# EAGLE design ChordController (EAGLE 5.10)

## Sheet 1 of 2
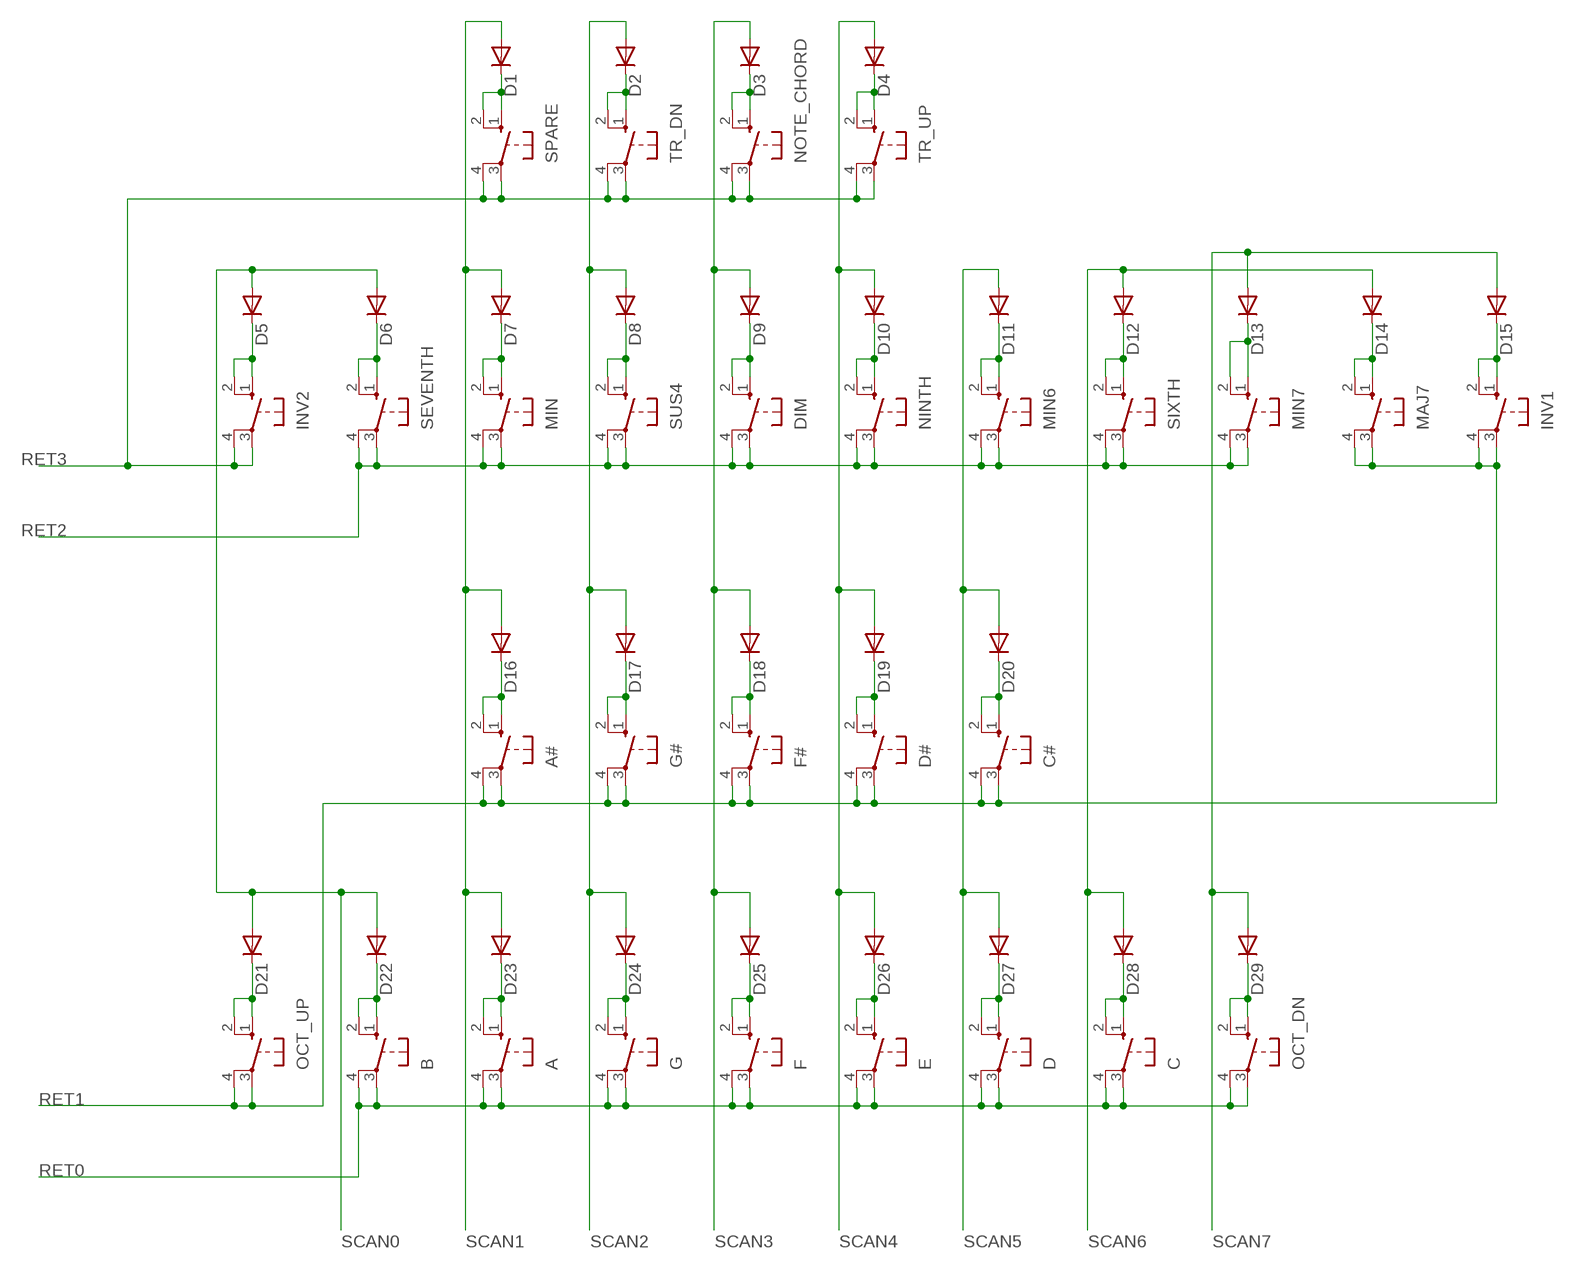
[diagram p0: schematic, sheet 1]

### Parts
A  40-XX  [B3F-40XX]
A#  40-XX  [B3F-40XX]
B  40-XX  [B3F-40XX]
C  40-XX  [B3F-40XX]
C#  40-XX  [B3F-40XX]
D  40-XX  [B3F-40XX]
D1  1N4148DO35-7  [DO35-7]
D2  1N4148DO35-7  [DO35-7]
D3  1N4148DO35-7  [DO35-7]
D4  1N4148DO35-7  [DO35-7]
D5  1N4148DO35-7  [DO35-7]
D6  1N4148DO35-7  [DO35-7]
D7  1N4148DO35-7  [DO35-7]
D8  1N4148DO35-7  [DO35-7]
D9  1N4148DO35-7  [DO35-7]
D10  1N4148DO35-7  [DO35-7]
D11  1N4148DO35-7  [DO35-7]
D12  1N4148DO35-7  [DO35-7]
D13  1N4148DO35-7  [DO35-7]
D14  1N4148DO35-7  [DO35-7]
D15  1N4148DO35-7  [DO35-7]
D16  1N4148DO35-7  [DO35-7]
D17  1N4148DO35-7  [DO35-7]
D18  1N4148DO35-7  [DO35-7]
D19  1N4148DO35-7  [DO35-7]
D20  1N4148DO35-7  [DO35-7]
D21  1N4148DO35-7  [DO35-7]
D22  1N4148DO35-7  [DO35-7]
D23  1N4148DO35-7  [DO35-7]
D24  1N4148DO35-7  [DO35-7]
D25  1N4148DO35-7  [DO35-7]
D26  1N4148DO35-7  [DO35-7]
D27  1N4148DO35-7  [DO35-7]
D28  1N4148DO35-7  [DO35-7]
D29  1N4148DO35-7  [DO35-7]
D#  40-XX  [B3F-40XX]
DIM  40-XX  [B3F-40XX]
E  40-XX  [B3F-40XX]
F  40-XX  [B3F-40XX]
F#  40-XX  [B3F-40XX]
G  40-XX  [B3F-40XX]
G#  40-XX  [B3F-40XX]
INV1  40-XX  [B3F-40XX]
INV2  40-XX  [B3F-40XX]
MAJ7  40-XX  [B3F-40XX]
MIN  40-XX  [B3F-40XX]
MIN6  40-XX  [B3F-40XX]
MIN7  40-XX  [B3F-40XX]
NINTH  40-XX  [B3F-40XX]
NOTE_CHORD  40-XX  [B3F-40XX]
OCT_DN  40-XX  [B3F-40XX]
OCT_UP  40-XX  [B3F-40XX]
SEVENTH  40-XX  [B3F-40XX]
SIXTH  40-XX  [B3F-40XX]
SPARE  40-XX  [B3F-40XX]
SUS4  40-XX  [B3F-40XX]
TR_DN  40-XX  [B3F-40XX]
TR_UP  40-XX  [B3F-40XX]

### Nets
N$6: D1.C SPARE.1(S) SPARE.2(S1)
N$13: D2.C TR_DN.1(S) TR_DN.2(S1)
N$14: D3.C NOTE_CHORD.1(S) NOTE_CHORD.2(S1)
N$15: D4.C TR_UP.1(S) TR_UP.2(S1)
N$16: D13.C MIN7.1(S) MIN7.2(S1)
N$17: D15.C INV1.1(S) INV1.2(S1)
N$18: D5.C INV2.1(S) INV2.2(S1)
N$19: D6.C SEVENTH.1(S) SEVENTH.2(S1)
N$20: D11.C MIN6.1(S) MIN6.2(S1)
N$21: D10.C NINTH.1(S) NINTH.2(S1)
N$22: D14.C MAJ7.1(S) MAJ7.2(S1)
N$23: D9.C DIM.1(S) DIM.2(S1)
N$24: D8.C SUS4.1(S) SUS4.2(S1)
N$25: D7.C MIN.1(S) MIN.2(S1)
N$26: A#.1(S) A#.2(S1) D16.C
N$27: D17.C G#.1(S) G#.2(S1)
N$28: D18.C F#.1(S) F#.2(S1)
N$29: D19.C D#.1(S) D#.2(S1)
N$30: C#.1(S) C#.2(S1) D20.C
N$31: B.1(S) B.2(S1) D22.C
N$32: A.1(S) A.2(S1) D23.C
N$33: D21.C OCT_UP.1(S) OCT_UP.2(S1)
N$34: D24.C G.1(S) G.2(S1)
N$35: D25.C F.1(S) F.2(S1)
N$36: D26.C E.1(S) E.2(S1)
N$37: D27.C D.1(S) D.2(S1)
N$38: C.1(S) C.2(S1) D28.C
N$39: D29.C OCT_DN.1(S) OCT_DN.2(S1)
N$40: D12.C SIXTH.1(S) SIXTH.2(S1)
RET0: A.3(P) A.4(P1) B.3(P) B.4(P1) C.3(P) C.4(P1) D.3(P) D.4(P1) E.3(P) E.4(P1) F.3(P) F.4(P1) G.3(P) G.4(P1) OCT_DN.3(P) OCT_DN.4(P1) ; also sheet 2
RET1: A#.3(P) A#.4(P1) C#.3(P) C#.4(P1) D#.3(P) D#.4(P1) F#.3(P) F#.4(P1) G#.3(P) G#.4(P1) INV1.3(P) INV1.4(P1) MAJ7.3(P) MAJ7.4(P1) OCT_UP.3(P) OCT_UP.4(P1) ; also sheet 2
RET2: DIM.3(P) DIM.4(P1) MIN6.3(P) MIN6.4(P1) MIN7.3(P) MIN7.4(P1) MIN.3(P) MIN.4(P1) NINTH.3(P) NINTH.4(P1) SEVENTH.3(P) SEVENTH.4(P1) SIXTH.3(P) SIXTH.4(P1) SUS4.3(P) SUS4.4(P1) ; also sheet 2
RET3: INV2.3(P) INV2.4(P1) NOTE_CHORD.3(P) NOTE_CHORD.4(P1) SPARE.3(P) SPARE.4(P1) TR_DN.3(P) TR_DN.4(P1) TR_UP.3(P) TR_UP.4(P1) ; also sheet 2
SCAN0: D5.A D6.A D21.A D22.A ; also sheet 2
SCAN1: D1.A D7.A D16.A D23.A ; also sheet 2
SCAN2: D2.A D8.A D17.A D24.A ; also sheet 2
SCAN3: D3.A D9.A D18.A D25.A ; also sheet 2
SCAN4: D4.A D10.A D19.A D26.A ; also sheet 2
SCAN5: D11.A D20.A D27.A ; also sheet 2
SCAN6: D12.A D14.A D28.A ; also sheet 2
SCAN7: D13.A D15.A D29.A ; also sheet 2

## Sheet 2 of 2
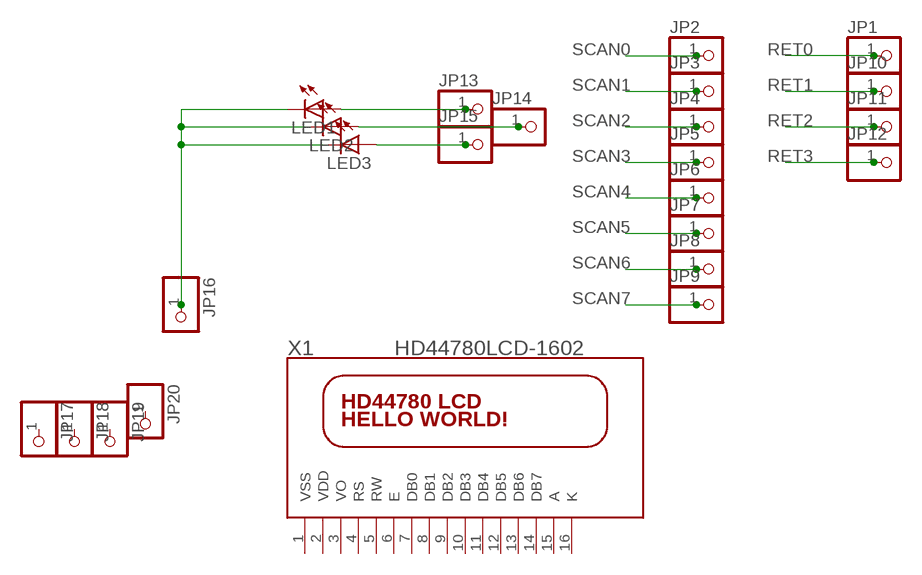
[diagram p1: schematic, sheet 2]

### Parts
JP1  PINHD-1X1  [1X01]
JP2  PINHD-1X1  [1X01]
JP3  PINHD-1X1  [1X01]
JP4  PINHD-1X1  [1X01]
JP5  PINHD-1X1  [1X01]
JP6  PINHD-1X1  [1X01]
JP7  PINHD-1X1  [1X01]
JP8  PINHD-1X1  [1X01]
JP9  PINHD-1X1  [1X01]
JP10  PINHD-1X1  [1X01]
JP11  PINHD-1X1  [1X01]
JP12  PINHD-1X1  [1X01]
JP13  PINHD-1X1  [1X01]
JP14  PINHD-1X1  [1X01]
JP15  PINHD-1X1  [1X01]
JP16  PINHD-1X1  [1X01]
JP17  PINHD-1X1  [1X01]
JP18  PINHD-1X1  [1X01]
JP19  PINHD-1X1  [1X01]
JP20  PINHD-1X1  [1X01]
LED1  LED3MM  [LED3MM]
LED2  LED3MM  [LED3MM]
LED3  LED3MM  [LED3MM]
X1  HD44780LCD-1602  [LCD1602]

### Nets
GND: JP16.1 LED1.K(C) LED2.K(C) LED3.K(C)
N$1: JP13.1 LED1.A
N$2: JP14.1 LED2.A
N$3: JP15.1 LED3.A
RET0: JP1.1 ; also sheet 1
RET1: JP10.1 ; also sheet 1
RET2: JP11.1 ; also sheet 1
RET3: JP12.1 ; also sheet 1
SCAN0: JP2.1 ; also sheet 1
SCAN1: JP3.1 ; also sheet 1
SCAN2: JP4.1 ; also sheet 1
SCAN3: JP5.1 ; also sheet 1
SCAN4: JP6.1 ; also sheet 1
SCAN5: JP7.1 ; also sheet 1
SCAN6: JP8.1 ; also sheet 1
SCAN7: JP9.1 ; also sheet 1
Unconnected: JP17.1 JP18.1 JP19.1 JP20.1 X1.1(VSS) X1.2(VDD) X1.3(VO) X1.4(RS) X1.5(RW) X1.6(E) X1.7(DB0) X1.8(DB1) X1.9(DB2) X1.10(DB3) X1.11(DB4) X1.12(DB5) X1.13(DB6) X1.14(DB7) X1.15(A) X1.16(K)

## Library data of the parts
A A# B C C# D D# DIM E F F# G G# INV1 INV2 MAJ7 MIN MIN6 MIN7 NINTH NOTE_CHORD OCT_DN OCT_UP SEVENTH SIXTH SPARE SUS4 TR_DN TR_UP = switch-omron:40-XX: OMRON SWITCH
D1-D29 = diode:1N4148: DIODE high speed (Philips)
JP1-JP20 = adafruit:PINHD-1X1: Pin header 1x1 for 0.1" spacing With round pins
LED1-LED3 = led:LED: LED OSRAM: - CHIPLED LG R971, LG N971, LY N971, LG Q971, LY Q971, LO R971, LY R971 LH N974, LH R974 LS Q976, LO Q976, LY Q976 LO Q996 - Hyper CHIPLED LW Q18S LB Q993, LB Q99A, LB R99A - SideLED LS A670, LO A670, LY A670, LG A670, LP A670 LB A673, LV A673, LT A673, LW A673 LH A674 LY A675 LS A676, LA A676, LO A676, LY A676, LW A676 LS A679, LY A679, LG A679 - Hyper Micro SIDELED® LS Y876, LA Y876, LO Y876, LY Y876 LT Y87S - SmartLED LW L88C, LW L88S LB L89C, LB L89S, LG L890 LS L89K, LO L89K, LY L89K LS L896, LA L896, LO L896, LY L896 - TOPLED LS T670, LO T670, LY T670, LG T670, LP T670 LSG T670, LSP T670, LSY T670, LOP T670, LYG T670 LG T671, LOG T671, LSG T671 LB T673, LV T673, LT T673, LW T673 LH T674 LS T676, LA T676, LO T676, LY T676, LB T676, LH T676, LSB T676, LW T676 LB T67C, LV T67C, LT T67C, LS T67K, LO T67K, LY T67K, LW E67C LS E67B, LA E67B, LO E67B, LY E67B, LB E67C, LV E67C, LT E67C LW T67C LS T679, LY T679, LG T679 LS T770, LO T770, LY T770, LG T770, LP T770 LB T773, LV T773, LT T773, LW T773 LH T774 LS E675, LA E675, LY E675, LS T675 LS T776, LA T776, LO T776, LY T776, LB T776 LHGB T686 LT T68C, LB T68C - Hyper Mini TOPLED® LB M676 - Mini TOPLED Santana® LG M470 LS M47K, LO M47K, LY M47K Source: http://www.osram.convergy.de LUXEON: - LUMILED® LXK2-PW12-R00, LXK2-PW12-S00, LXK2-PW14-U00, LXK2-PW14-V00 LXK2-PM12-R00, LXK2-PM12-S00, LXK2-PM14-U00 LXK2-PE12-Q00, LXK2-PE12-R00, LXK2-PE12-S00, LXK2-PE14-T00, LXK2-PE14-U00 LXK2-PB12-K00, LXK2-PB12-L00, LXK2-PB12-M00, LXK2-PB14-N00, LXK2-PB14-P00, LXK2-PB14-Q00 LXK2-PR12-L00, LXK2-PR12-M00, LXK2-PR14-Q00, LXK2-PR14-R00 LXK2-PD12-Q00, LXK2-PD12-R00, LXK2-PD12-S00 LXK2-PH12-R00, LXK2-PH12-S00 LXK2-PL12-P00, LXK2-PL12-Q00, LXK2-PL12-R00 Source: www.luxeon.com KINGBRIGHT: KA-3528ASYC Source: www.kingbright.com
X1 = adafruit:HD44780LCD: HD44780 LCD Standard character type LCDs, available in sizes from 8x1 to 40x4!

## Board
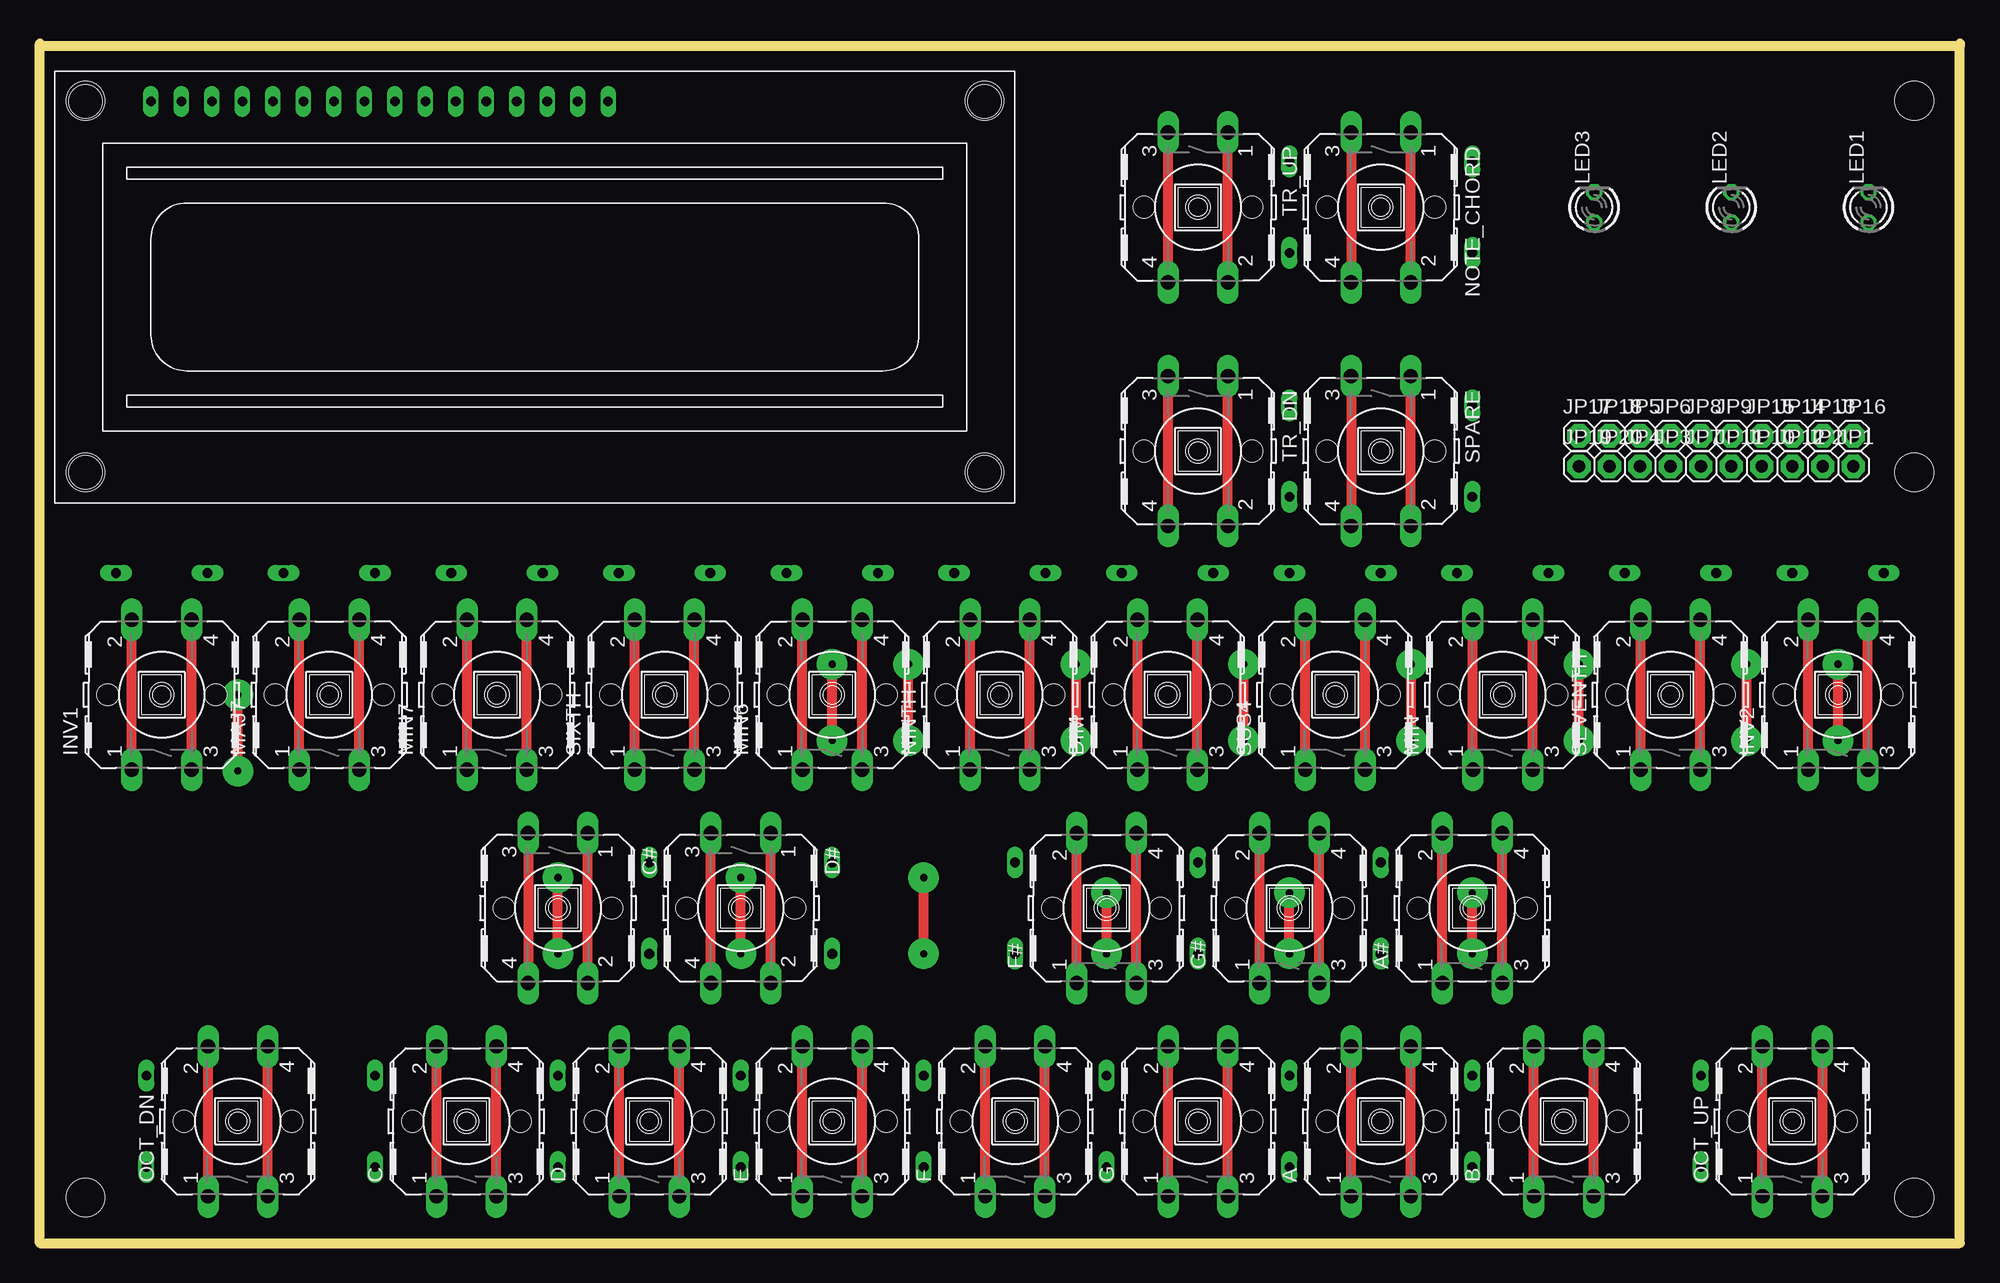
[diagram p2: board, top side]
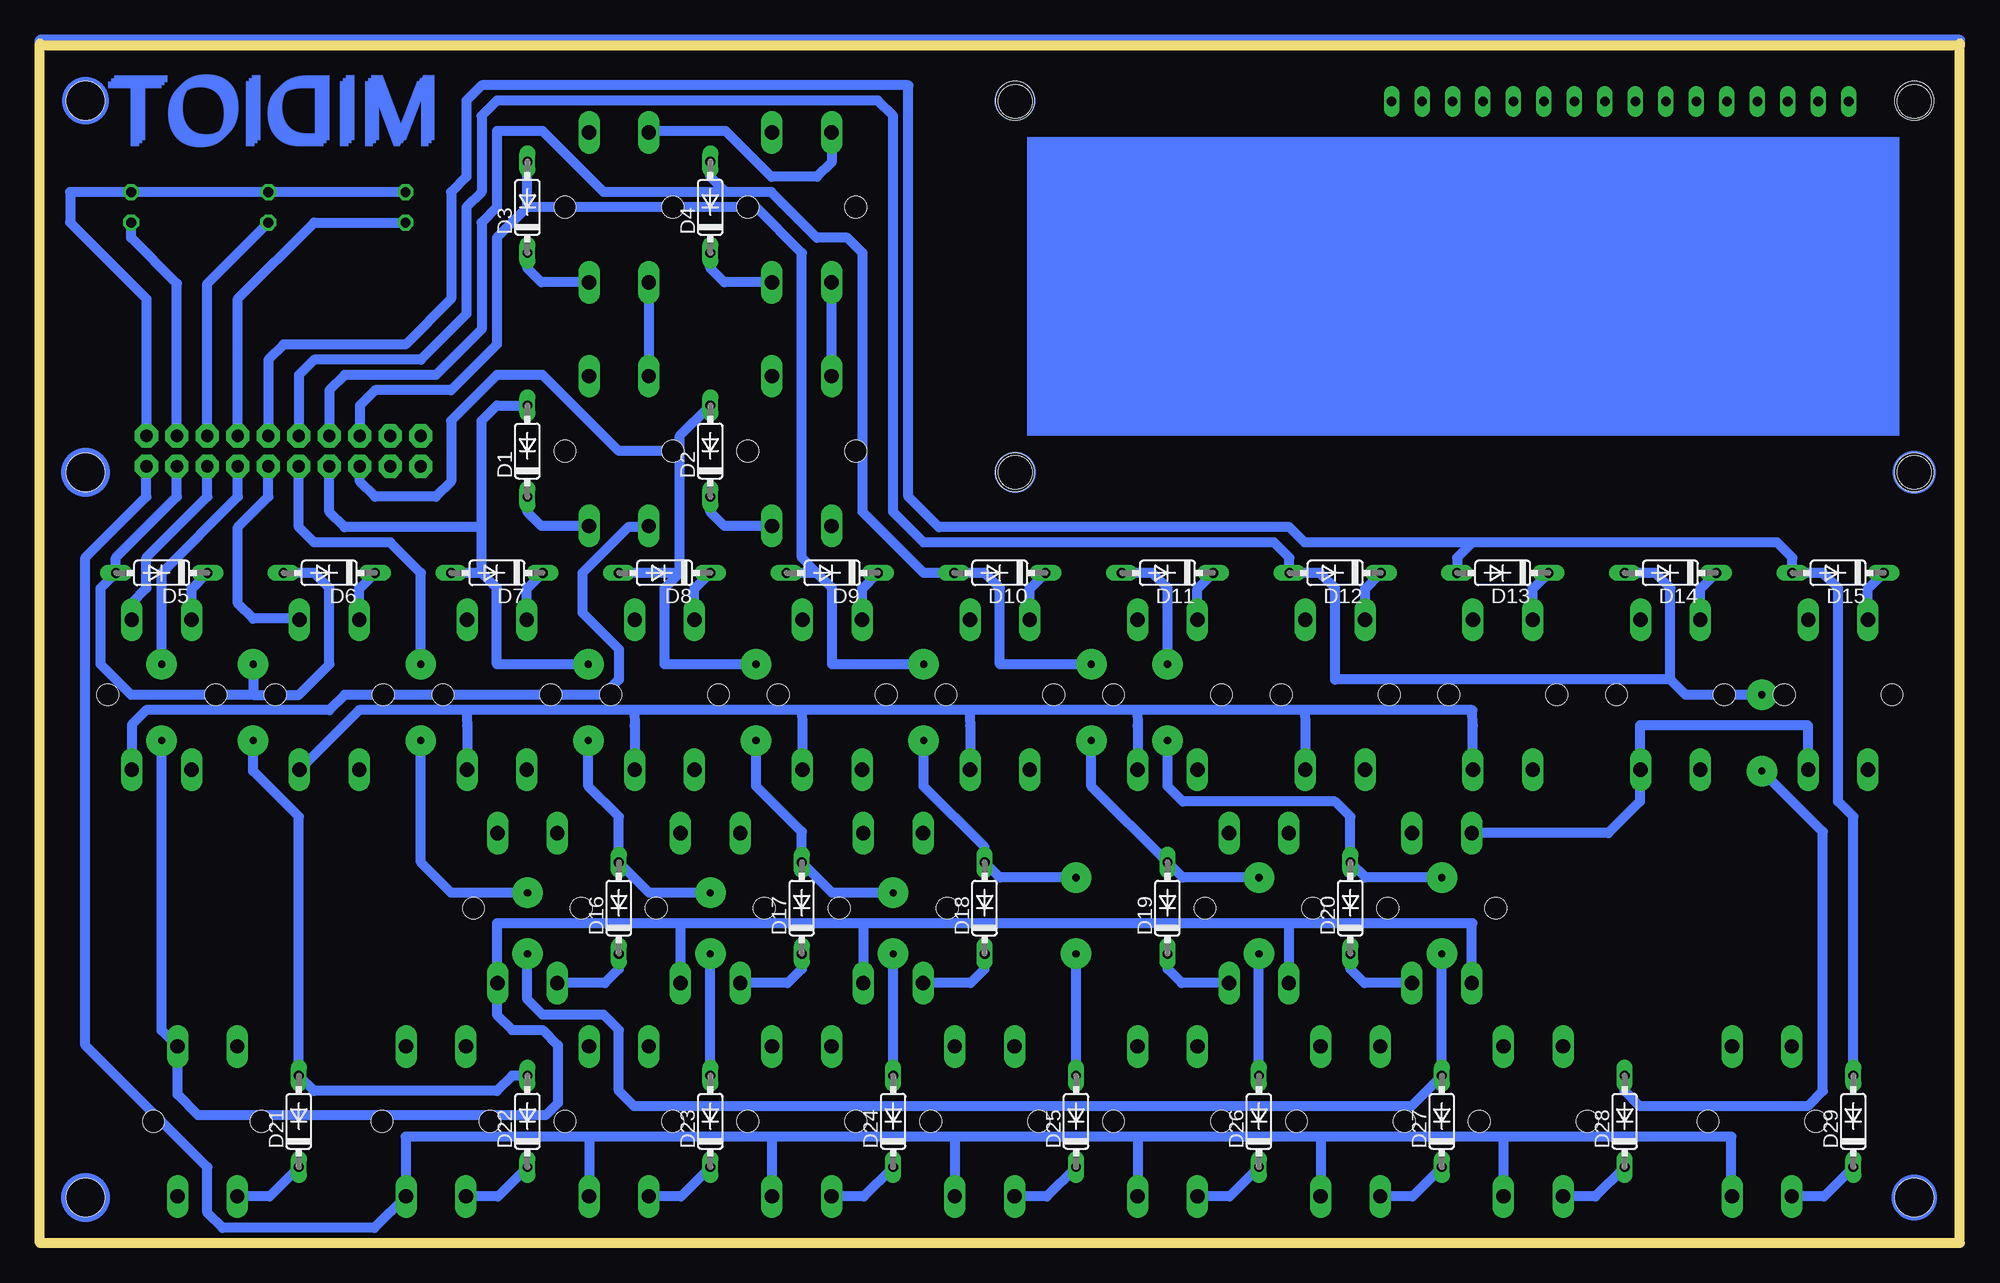
[diagram p3: board, bottom side, seen from below]

Size 160.02 x 100 mm. Coordinates in mm from the lower left corner, seen from the top.
Outline: 0,99.82 0,0 160.02,0 160.02,100
Outline: 0,99.82 0,100
Outline: 0,99.82 160.02,99.82
Copper layers (1*16): Top 0.035mm / dielectric 1.5mm / Bottom 0.035mm
Design rules "default": minimum track width 10mil, minimum drill 24mil, track to track 8mil, track to pad 8mil, pad to pad 8mil, via to via 8mil, smd to smd 8mil, copper to edge 40mil, drill to drill 8mil, minimum pad ring 10mil, minimum via ring 8mil, stop-mask expansion 4mil, vias tented up to drill 0mil, thermal gap 10mil
Holes 3.2 mm at 156.21,95.25 3.81,95.25 156.21,3.81 3.81,3.81 3.81,64.26 78.74,95.25 78.74,64.26 156.21,64.26

### Footprints (pad centres in the part's own frame; a part is rotated, then mirrored left to right if it is on the bottom)
B3F-40XX = drill 1.194 long: 1 -6.248,2.489; 2 6.248,2.489; 3 -6.248,-2.489; 4 6.248,-2.489 | hole 1.803: 0,-4.496; 0,4.496
DO35-7 = drill 0.813 long: A 3.81,0; C -3.81,0
1X01 = drill 1.016 pad 1.93 octagon: 1 0,0
LED3MM = drill 0.813 octagon: A -1.27,0; K 1.27,0
LCD1602 = drill 0.8 long: 1 8,33.46; 2 10.54,33.46; 3 13.08,33.46; 4 15.62,33.46; 5 18.16,33.46; 6 20.7,33.46; 7 23.24,33.46; 8 25.78,33.46; 9 28.32,33.46; 10 30.86,33.46; 11 33.4,33.46; 12 35.94,33.46; 13 38.48,33.46; 14 41.02,33.46; 15 43.56,33.46; 16 46.1,33.46 | hole 2.8: 2.54,2.54; 2.54,33.46; 77.46,33.46; 77.46,2.54

### Placement (x,y rotation side)
A  111.76,10.16 90 top
A#  119.38,27.94 90 top
B  127,10.16 90 top
C  35.56,10.16 90 top
C#  43.18,27.94 270 top
D  50.8,10.16 90 top
D1  119.38,66.04 90 bottom
D2  104.14,66.04 90 bottom
D3  119.38,86.36 90 bottom
D4  104.14,86.36 90 bottom
D5  149.86,55.88 180 bottom
D6  135.89,55.88 180 bottom
D7  121.92,55.88 180 bottom
D8  107.95,55.88 180 bottom
D9  93.98,55.88 180 bottom
D10  80.01,55.88 180 bottom
D11  66.04,55.88 180 bottom
D12  52.07,55.88 180 bottom
D13  38.1,55.88 180 bottom
D14  24.13,55.88 180 bottom
D15  10.16,55.88 180 bottom
D16  111.76,27.94 90 bottom
D17  96.52,27.94 90 bottom
D18  81.28,27.94 90 bottom
D19  66.04,27.94 90 bottom
D20  50.8,27.94 90 bottom
D21  138.43,10.16 90 bottom
D22  119.38,10.16 90 bottom
D23  104.14,10.16 90 bottom
D24  88.9,10.16 90 bottom
D25  73.66,10.16 90 bottom
D26  58.42,10.16 90 bottom
D27  43.18,10.16 90 bottom
D28  27.94,10.16 90 bottom
D29  8.89,10.16 90 bottom
D#  58.42,27.94 270 top
DIM  93.98,45.72 90 top
E  66.04,10.16 90 top
F  81.28,10.16 90 top
F#  88.9,27.94 90 top
G  96.52,10.16 90 top
G#  104.14,27.94 90 top
INV1  10.16,45.72 90 top
INV2  149.86,45.72 90 top
JP1  151.13,64.77 0 top
JP2  148.59,64.77 0 top
JP3  135.89,64.77 0 top
JP4  133.35,64.77 0 top
JP5  133.35,67.31 0 top
JP6  135.89,67.31 0 top
JP7  138.43,64.77 0 top
JP8  138.43,67.31 0 top
JP9  140.97,67.31 0 top
JP10  143.51,64.77 0 top
JP11  140.97,64.77 0 top
JP12  146.05,64.77 0 top
JP13  148.59,67.31 0 top
JP14  146.05,67.31 0 top
JP15  143.51,67.31 0 top
JP16  151.13,67.31 0 top
JP17  128.27,67.31 0 top
JP18  130.81,67.31 0 top
JP19  128.27,64.77 0 top
JP20  130.81,64.77 0 top
LED1  152.4,86.36 90 top
LED2  140.97,86.36 90 top
LED3  129.54,86.36 90 top
MAJ7  24.13,45.72 90 top
MIN  121.92,45.72 90 top
MIN6  66.04,45.72 90 top
MIN7  38.1,45.72 90 top
NINTH  80.01,45.72 90 top
NOTE_CHORD  111.76,86.36 270 top
OCT_DN  16.51,10.16 90 top
OCT_UP  146.05,10.16 90 top
SEVENTH  135.89,45.72 90 top
SIXTH  52.07,45.72 90 top
SPARE  111.76,66.04 270 top
SUS4  107.95,45.72 90 top
TR_DN  96.52,66.04 270 top
TR_UP  96.52,86.36 270 top
X1  1.27,61.72 0 top

### Tracks (layer width: path | path; a pad name or v marks a point on that pad's centre or on a via)
GND
  Bottom 0.813: JP16.1 151.13,78.74 157.48,85.09 157.48,87.63 LED1.K LED2.K LED3.K
N$1
  Bottom 0.813: JP13.1 148.59,80.01 152.4,83.82 LED1.A
N$2
  Bottom 0.813: JP14.1 146.05,80.01 LED2.A
N$3
  Bottom 0.813: JP15.1 143.51,78.74 137.16,85.09 LED3.A
N$6
  Top 0.813: SPARE.2 SPARE.1
  Bottom 0.813: SPARE.2 118.21,59.79 119.38,60.96 D1.C
N$8
  Bottom 0.813: 160.02,0 160.02,100.33 0,100.33 0,0 160.02,0
N$13
  Top 0.813: TR_DN.2 TR_DN.1
  Bottom 0.813: TR_DN.2 102.97,59.79 104.14,60.96 D2.C
N$14
  Top 0.813: NOTE_CHORD.2 NOTE_CHORD.1
  Bottom 0.813: NOTE_CHORD.2 118.21,80.11 119.38,81.28 D3.C
N$15
  Top 0.813: TR_UP.2 TR_UP.1
  Bottom 0.813: TR_UP.2 102.97,80.11 104.14,81.28 D4.C
N$16
  Top 0.813: MIN7.1 MIN7.2
  Bottom 0.813: MIN7.2 35.61,54.56 D13.C
N$17
  Top 0.813: INV1.1 INV1.2
  Bottom 0.813: INV1.2 7.67,54.56 D15.C
N$18
  Top 0.813: INV2.1 INV2.2
  Bottom 0.813: INV2.2 147.37,54.56 D5.C
N$19
  Top 0.813: SEVENTH.1 SEVENTH.2
  Bottom 0.813: SEVENTH.2 133.4,54.56 D6.C
N$20
  Top 0.813: MIN6.1 MIN6.2
  Bottom 0.813: MIN6.2 63.55,54.56 D11.C
N$21
  Top 0.813: NINTH.1 NINTH.2
  Bottom 0.813: NINTH.2 77.52,54.56 D10.C
N$22
  Top 0.813: MAJ7.1 MAJ7.2
  Bottom 0.813: MAJ7.2 21.64,54.56 D14.C
N$23
  Top 0.813: DIM.1 DIM.2
  Bottom 0.813: DIM.2 91.49,54.56 D9.C
N$24
  Top 0.813: SUS4.1 SUS4.2
  Bottom 0.813: SUS4.2 105.46,54.56 D8.C
N$25
  Top 0.813: MIN.1 MIN.2
  Bottom 0.813: MIN.2 119.43,54.56 D7.C
N$26
  Top 0.813: A#.1 A#.2
  Bottom 0.813: A#.1 112.93,21.69 111.76,22.86 D16.C
N$27
  Top 0.813: G#.1 G#.2
  Bottom 0.813: G#.1 97.69,21.69 96.52,22.86 D17.C
N$28
  Top 0.813: F#.1 F#.2
  Bottom 0.813: F#.1 82.45,21.69 81.28,22.86 D18.C
N$29
  Top 0.813: D#.1 D#.2 60.91,21.64 60.96,21.59
  Bottom 0.813: D#.2 64.87,21.69 66.04,22.86 D19.C
N$30
  Top 0.813: C#.2 C#.1
  Bottom 0.813: C#.2 49.63,21.69 50.8,22.86 D20.C
N$31
  Top 0.813: B.1 B.2
  Bottom 0.813: B.1 121.82,3.91 D22.C
N$32
  Top 0.813: A.1 A.2
  Bottom 0.813: A.1 106.58,3.91 D23.C
N$33
  Top 0.813: OCT_UP.1 OCT_UP.2
  Bottom 0.813: OCT_UP.1 140.87,3.91 D21.C
N$34
  Top 0.813: G.1 G.2
  Bottom 0.813: G.1 91.34,3.91 D24.C
N$35
  Top 0.813: F.1 F.2
  Bottom 0.813: F.1 76.1,3.91 D25.C
N$36
  Top 0.813: E.1 E.2
  Bottom 0.813: E.1 60.86,3.91 D26.C
N$37
  Top 0.813: D.1 D.2
  Bottom 0.813: D.1 45.62,3.91 D27.C
N$38
  Top 0.813: C.1 C.2
  Bottom 0.813: C.1 30.38,3.91 D28.C
N$39
  Top 0.813: OCT_DN.1 OCT_DN.2
  Bottom 0.813: OCT_DN.1 11.33,3.91 D29.C
N$40
  Top 0.813: SIXTH.1 SIXTH.2
  Bottom 0.813: SIXTH.2 49.58,54.56 D12.C
RET0
  Top 0.813: OCT_DN.3 OCT_DN.4 | C.3 C.4 | D.3 D.4 | E.3 E.4 | F.3 F.4 | G.3 G.4 | A.3 A.4 | B.3 B.4
  Bottom 0.813: C.3 38.05,8.84 38.1,8.89 | 38.1,8.89 53.34,8.89 | 53.34,8.89 68.58,8.89 | 68.58,8.89 83.82,8.89 | 83.82,8.89 99.06,8.89 | 99.06,8.89 114.3,8.89 | 114.3,8.89 129.54,8.89 129.54,3.96 B.3 132.13,1.27 144.78,1.27 146.05,2.54 146.05,6.35 156.21,16.51 156.21,57.15 151.13,62.23 JP1.1 | A.3 114.25,8.84 114.3,8.89 | G.3 99.01,8.84 99.06,8.89 | F.3 83.77,8.84 83.82,8.89 | E.3 68.53,8.84 68.58,8.89 | D.3 53.29,8.84 53.34,8.89 | 38.1,8.89 19.05,8.89 19.05,3.96 OCT_DN.3
RET1  (via drill 0.6 pad 2.54)
  Top 0.813: v149.86,41.91 v149.86,48.26 | INV1.3 INV1.4 | MAJ7.3 MAJ7.4 | C#.3 C#.4 | D#.4 D#.3 | F#.3 F#.4 | G#.3 G#.4 | A#.3 A#.4 | OCT_UP.4 OCT_UP.3
  Bottom 0.813: C#.4 40.69,26.62 40.64,26.67 55.88,26.67 | 55.88,26.67 91.44,26.67 | 91.44,26.67 106.68,26.67 | 106.68,26.67 121.92,26.67 121.92,21.74 | 121.92,21.74 A#.3 | G#.3 106.63,26.62 106.68,26.67 | F#.3 91.39,26.62 91.44,26.67 | D#.4 55.93,26.62 55.88,26.67 | INV1.3 12.65,43.13 12.7,43.18 26.67,43.18 26.67,39.52 MAJ7.3 26.67,39.42 26.67,36.83 29.31,34.19 C#.3 | 121.92,21.74 121.92,19.05 120.65,17.78 118.11,17.78 116.84,16.51 116.84,11.68 117.86,10.67 146.81,10.67 148.54,12.39 OCT_UP.4 149.86,17.73 v149.86,41.91 | 148.59,3.81 148.59,3.86 OCT_UP.3 | v149.86,48.26 149.86,55.88 143.51,62.23 JP10.1
RET2
  Top 0.813: MIN7.3 MIN7.4 | SIXTH.3 SIXTH.4 | MIN6.3 MIN6.4 | NINTH.3 NINTH.4 | DIM.3 DIM.4 | SUS4.3 SUS4.4 | SUS4.3 110.44,39.42 110.49,39.37 110.49,39.42 SUS4.3 | MIN.3 MIN.4 | SEVENTH.3 SEVENTH.4
  Bottom 0.813: MIN7.3 40.59,43.13 40.64,44.45 54.61,44.45 | 54.61,44.45 68.58,44.45 | 68.58,44.45 82.55,44.45 | 82.55,44.45 96.52,44.45 | 96.52,44.45 110.49,44.45 | 110.49,44.45 124.46,44.45 | 138.43,39.52 SEVENTH.3 133.4,44.45 124.46,44.45 | MIN.3 124.41,43.13 124.46,44.45 | SUS4.3 110.44,43.13 110.49,44.45 | DIM.3 96.47,43.13 96.52,44.45 | NINTH.3 82.5,43.13 82.55,44.45 | MIN6.3 68.53,43.13 68.58,44.45 | SIXTH.3 54.56,43.13 54.61,44.45 | SEVENTH.4 138.48,52.07 142.24,52.07 143.51,53.34 143.51,59.69 140.97,62.23 JP11.1
RET3
  Top 0.813: INV2.3 INV2.4 | TR_DN.4 TR_DN.3 | SPARE.3 SPARE.4 | TR_UP.4 TR_UP.3 | NOTE_CHORD.3 NOTE_CHORD.4
  Bottom 0.813: TR_UP.4 94.03,72.44 93.98,72.39 94.03,72.34 TR_DN.3 | NOTE_CHORD.4 SPARE.3 | INV2.4 152.35,53.39 151.13,54.61 151.13,57.15 146.05,62.23 JP12.1 | INV2.3 152.35,43.23 151.13,44.45 135.89,44.45 134.62,45.72 113.03,45.72 111.76,46.99 111.76,49.53 114.81,52.58 114.81,55.88 111,59.69 109.37,59.69 SPARE.4 | TR_UP.3 94.03,90.12 95.25,88.9 99.06,88.9 102.87,92.71 109.17,92.71 NOTE_CHORD.3
SCAN0  (via drill 0.6 pad 2.54)
  Top 0.813: v142.24,41.91 v142.24,48.26
  Bottom 0.813: D22.A 120.65,13.97 121.92,12.7 137.16,12.7 D21.A 138.43,35.56 142.24,39.37 v142.24,41.91 | D6.A 137.16,55.88 135.89,54.61 135.89,48.26 138.43,45.72 142.24,45.72 | 142.24,45.72 152.4,45.72 154.94,48.26 154.94,54.61 D5.A 153.67,57.15 148.59,62.23 JP2.1 | v142.24,48.26 142.24,45.72
SCAN1  (via drill 0.6 pad 2.54)
  Top 0.813: v104.14,24.13 v104.14,29.21 | v114.3,41.91 v114.3,48.26
  Bottom 0.813: D23.A v104.14,24.13 | v104.14,29.21 109.22,29.21 D16.A 111.76,35.56 114.3,38.1 v114.3,41.91 | v114.3,48.26 121.92,48.26 121.92,54.61 123.19,55.88 | 123.19,55.88 D7.A | 123.19,55.88 123.19,59.69 | 123.19,59.69 123.19,68.58 121.92,69.85 D1.A | JP3.1 135.89,60.96 134.62,59.69 123.19,59.69
SCAN2  (via drill 0.6 pad 2.54)
  Top 0.813: v88.9,24.13 v88.9,29.21 | v100.33,41.91 v100.33,48.26
  Bottom 0.813: D24.A v88.9,24.13 | v88.9,29.21 93.98,29.21 D17.A 96.52,34.29 100.33,38.1 v100.33,41.91 | v100.33,48.26 107.95,48.26 107.95,54.61 106.68,55.88 | 106.68,55.88 106.68,66.04 | 106.68,66.04 106.68,67.31 D2.A | 106.68,55.88 D8.A | 106.68,66.04 111.76,66.04 118.11,72.39 121.92,72.39 125.73,68.58 125.73,63.5 127,62.23 132.08,62.23 133.35,63.5 JP4.1
SCAN3  (via drill 0.6 pad 2.54)
  Top 0.813: v73.66,24.13 v73.66,30.48 | v86.36,41.91 v86.36,48.26
  Bottom 0.813: D25.A v73.66,24.13 | v73.66,30.48 80.01,30.48 D18.A 81.28,33.02 86.36,38.1 v86.36,41.91 | v86.36,48.26 93.98,48.26 93.98,54.61 95.25,55.88 | 95.25,55.88 D9.A | 95.25,55.88 96.52,57.15 96.52,82.55 100.33,86.36 119.38,86.36 | 119.38,86.36 D3.A | 119.38,86.36 121.92,83.82 121.92,74.93 125.73,71.12 132.08,71.12 133.35,69.85 JP5.1
SCAN4  (via drill 0.6 pad 2.54)
  Top 0.813: v58.42,24.13 v58.42,30.48 | v72.39,41.91 v72.39,48.26
  Bottom 0.813: D26.A v58.42,24.13 | v58.42,30.48 64.77,30.48 D19.A 72.39,38.1 v72.39,41.91 | v72.39,48.26 80.01,48.26 80.01,54.61 81.28,55.88 D10.A 86.36,55.88 91.44,60.96 91.44,82.55 92.71,83.82 95.25,83.82 99.06,87.63 102.87,87.63 | D4.A 104.14,88.9 102.87,87.63 | 102.87,87.63 113.03,87.63 118.11,92.71 121.92,92.71 121.92,86.36 123.19,85.09 123.19,76.2 127,72.39 134.62,72.39 135.89,71.12 JP6.1
SCAN5  (via drill 0.6 pad 2.54)
  Top 0.813: v43.18,24.13 v43.18,30.48 | v66.04,41.91 v66.04,48.26 | v119.38,24.13 v119.38,29.21 | v128.27,41.91 v128.27,48.26
  Bottom 0.813: v43.18,24.13 D27.A 45.72,11.43 110.49,11.43 111.76,12.7 111.76,17.78 113.03,19.05 118.11,19.05 119.38,20.32 v119.38,24.13 | v43.18,30.48 49.53,30.48 D20.A 50.8,35.56 52.07,36.83 64.77,36.83 66.04,38.1 v66.04,41.91 | v66.04,48.26 66.04,54.61 67.31,55.88 D11.A | v119.38,29.21 125.73,29.21 128.27,31.75 v128.27,41.91 | v128.27,48.26 128.27,55.88 130.81,58.42 137.16,58.42 138.43,59.69 JP7.1
SCAN6  (via drill 0.6 pad 2.54)
  Top 0.813: v16.51,39.37 v16.51,45.72
  Bottom 0.813: D28.A 27.94,12.7 26.67,11.43 12.7,11.43 11.43,12.7 11.43,34.29 v16.51,39.37 | v16.51,45.72 22.86,45.72 24.13,46.99 | 24.13,46.99 24.13,54.61 25.4,55.88 D14.A | 24.13,46.99 52.07,46.99 52.07,54.61 53.34,55.88 D12.A 55.88,57.15 57.15,58.42 86.36,58.42 88.9,60.96 88.9,93.98 90.17,95.25 121.92,95.25 123.19,93.98 123.19,87.63 124.46,86.36 124.46,77.47 128.27,73.66 137.16,73.66 138.43,72.39 JP8.1
SCAN7
  Bottom 0.813: 40.64,58.42 15.24,58.42 13.97,57.15 D15.A 11.43,55.88 10.16,54.61 10.16,36.83 8.89,35.56 D29.A | D13.A 41.91,57.15 40.64,58.42 | 40.64,58.42 54.61,58.42 55.88,59.69 85.09,59.69 87.63,62.23 87.63,96.52 123.19,96.52 124.46,95.25 124.46,88.9 125.73,87.63 125.73,78.74 129.54,74.93 139.7,74.93 140.97,73.66 JP9.1
(copper drawn outside any net)
  shapes: Bottom area x1, Bottom circle x8

### Text on the board
Bottom: MIDIOT | MIDIOT | MIDIOT